# EAGLE design panatap (EAGLE 8.2.2)
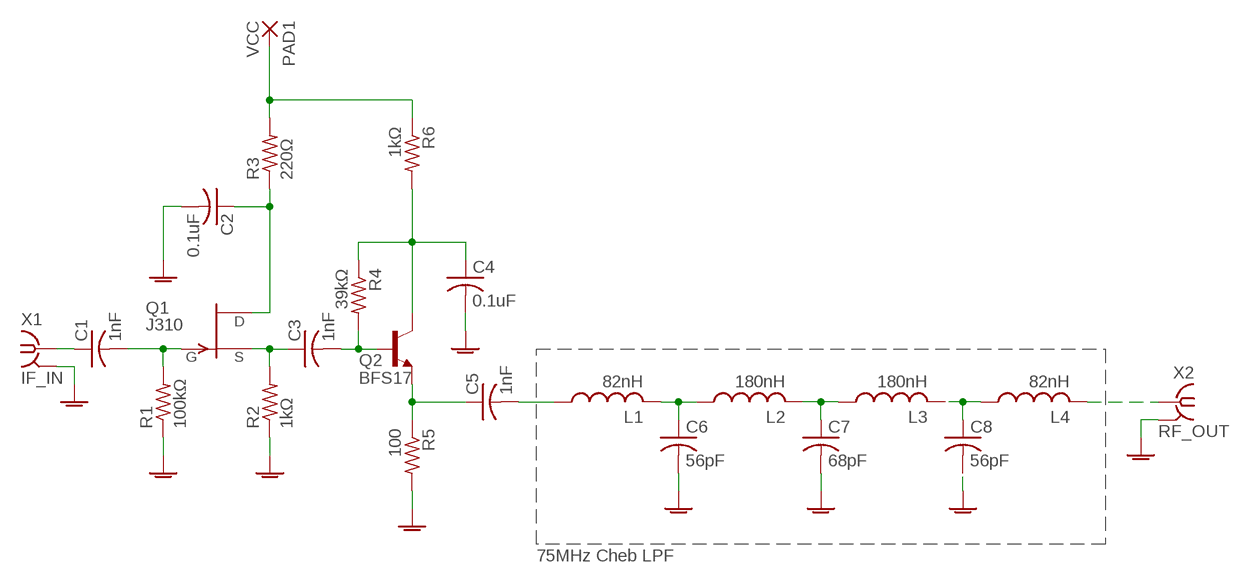
[diagram p0: schematic, sheet 1]

## Parts
C1  1nF  C-USC1206  [C1206]
C2  0.1uF  C-USC1206  [C1206]
C3  1nF  C-USC1206  [C1206]
C4  0.1uF  C-USC1206  [C1206]
C5  1nF  C-USC1206  [C1206]
C6  56pF  C-USC1206  [C1206]
C7  68pF  C-USC1206  [C1206]
C8  56pF  C-USC1206  [C1206]
L1  82nH  L-USL2012C  [L2012C]
L2  180nH  L-USL2012C  [L2012C]
L3  180nH  L-USL2012C  [L2012C]
L4  82nH  L-USL2012C  [L2012C]
PAD1  VCC  WIREPADSMD2,54-5,08  [SMD2,54-5,08]
Q1  J310  SST201  [SOT23]
Q2  BFS17  BC846  [SOT23]
R1  100kΩ  R-US_R1206  [R1206]
R2  1kΩ  R-US_R1206  [R1206]
R3  220Ω  R-US_R1206  [R1206]
R4  39kΩ  R-US_R1206  [R1206]
R5  100  R-US_R1206  [R1206]
R6  1kΩ  R-US_R1206  [R1206]
X1  IF_IN  SMA-142-0701-801/806  [J502-ND-142-0701-801/806]
X2  RF_OUT  SMA-142-0701-801/806  [J502-ND-142-0701-801/806]

## Nets
GNDA: C2.2 C4.2 C6.2 C7.2 C8.2 R1.1 R2.1 R5.2 X1.G@1 X1.G@2 X1.G@3 X1.G@4 X2.G@1 X2.G@2 X2.G@3 X2.G@4
N$1: C5.1 Q2.2(E) R5.1
N$2: C5.2 L1.1
N$3: C6.1 L1.2 L2.1
N$4: C3.2 Q2.1(B) R4.2
N$5: C3.1 Q1.2(S) R2.2
N$6: C1.2 Q1.3(G) R1.2
N$7: C1.1 X1.1
N$8: PAD1.1(P) R3.2 R6.1
N$9: C2.1 Q1.1(D) R3.1
N$10: C4.1 Q2.3(C) R4.1 R6.2
N$11: C7.1 L2.2 L3.1
N$12: L4.2 X2.1
N$13: C8.1 L3.2 L4.1

## Notes on the sheet
- 75MHz Cheb LPF

## Library data of the parts
C1-C8 = resistor:C-US: CAPACITOR, American symbol
L1-L4 = resistor:L-US: INDUCTOR, American symbol
PAD1 = wirepad:WIREPAD: Wire PAD connect wire on PCB
Q1 = transistor-fet:?20*: TEMIC / Siliconix N-Channel JFET Source: JFET-J201_Siliconix_data.pdf
Q2 = transistor:BC846: NPN TRANSISTOR
R1-R6 = resistor:R-US_: RESISTOR, American symbol
X1 X2 = con-coax:SMA-: SMA 50 Ohm End Launch Jack Receptacle - Round Contact Johnson Components Source: www.johnsoncomponents.com .. J502-ND.pdf; MF: JOHNSON COMPONENTS; MPN: 142-0701-801; OC_FARNELL: 1608592; OC_NEWARK: 90F2624

## Board
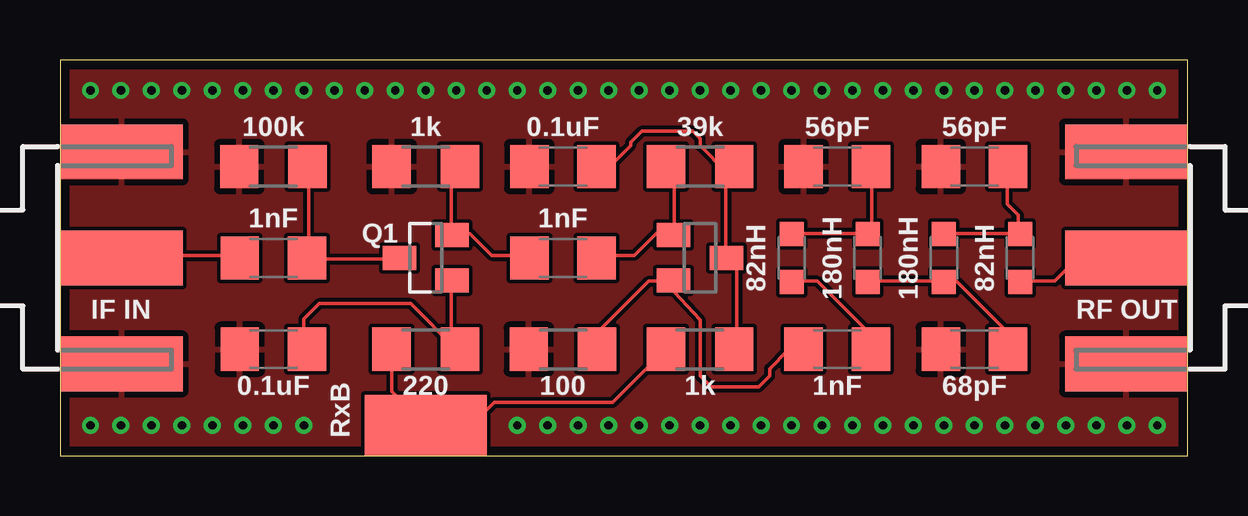
[diagram p1: board, top side]
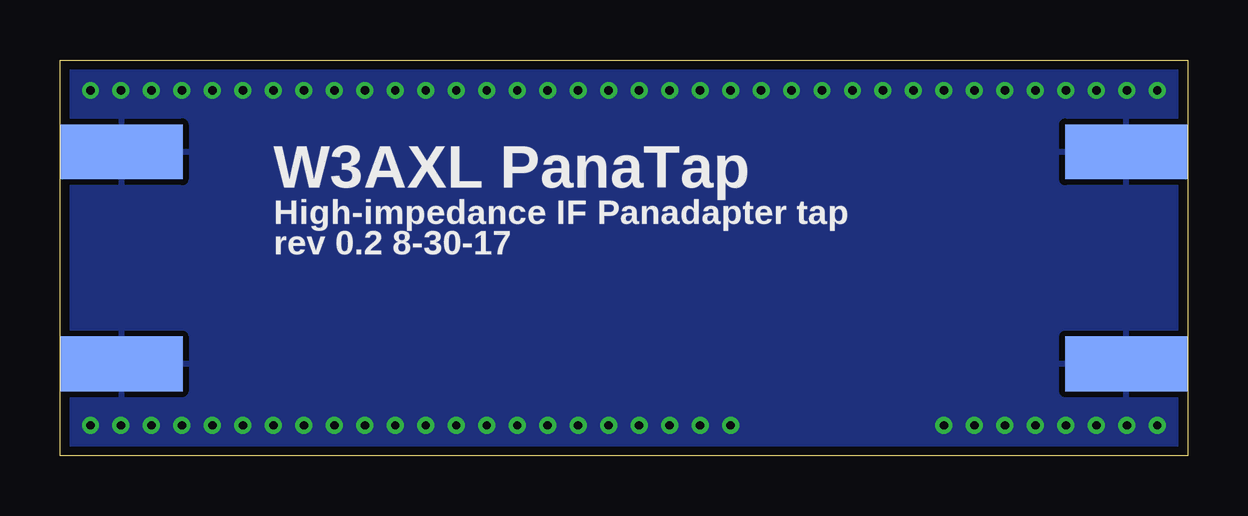
[diagram p2: board, bottom side, seen from below]

Size 46.99 x 16.51 mm. Coordinates in mm from the lower left corner, seen from the top.
Outline: 0,0 46.99,0 46.99,16.51 0,16.51 0,0
Copper layers (1*16): Top 0.0356mm / dielectric 1.5011mm / Bottom 0.0356mm
Design rules "LaenPCBOrder": minimum track width 6mil, minimum drill 13mil, track to track 6mil, track to pad 6mil, pad to pad 6mil, via to via 6mil, smd to smd 6mil, copper to edge 15mil, drill to drill 6mil, minimum pad ring 7mil, minimum via ring 7mil, stop-mask expansion 3mil, vias tented up to drill 0mil, thermal gap 10mil

### Footprints (pad centres in the part's own frame; a part is rotated, then mirrored left to right if it is on the bottom)
C1206 = smd 1.6 x 1.8: 1 -1.4,0; 2 1.4,0
L2012C = smd 1 x 1: 1 -1,0; 2 1,0
SMD2,54-5,08 = smd 2.54 x 5.08: 1 0,0
SOT23 = smd 1 x 1.4: 1 -0.95,-1.1; 2 0.95,-1.1; 3 0,1.1
R1206 = smd 1.6 x 1.803: 1 -1.422,0; 2 1.422,0
J502-ND-142-0701-801/806 = smd 5.08 x 2.286: 1 2.565,0; G@1 2.565,4.42; G@2 2.565,-4.42 | smd 5.08 x 2.286 bottom: G@3 2.565,4.42; G@4 2.565,-4.42

### Placement (x,y rotation side)
C1  8.89,8.25 0 top
C2  8.89,4.45 180 top
C3  20.95,8.25 0 top
C4  20.95,12.07 180 top
C5  32.38,4.45 0 top
C6  32.38,12.07 180 top
C7  38.1,4.45 180 top
C8  38.1,12.07 180 top
L1  30.48,8.25 90 top
L2  33.66,8.25 270 top
L3  36.83,8.25 90 top
L4  40.01,8.25 270 top
PAD1  15.24,1.27 270 top
Q1  15.24,8.25 90 top
Q2  26.67,8.25 270 top
R1  8.89,12.07 0 top
R2  15.24,12.07 0 top
R3  15.24,4.45 180 top
R4  26.67,12.07 180 top
R5  20.95,4.45 180 top
R6  26.67,4.45 0 top
X1  0,8.25 0 top
X2  46.99,8.25 180 top

### Tracks (layer width: path | path; a pad name or v marks a point on that pad's centre or on a via)
GNDA  (via drill 0.35)
  other vias: 1.27,15.24 1.27,1.27 45.72,15.24 2.54,15.24 2.54,1.27 3.81,1.27 5.08,1.27 6.35,1.27 7.62,1.27 8.89,1.27 10.16,1.27 3.81,15.24 5.08,15.24 6.35,15.24 7.62,15.24 8.89,15.24 10.16,15.24 11.43,15.24 12.7,15.24 13.97,15.24 15.24,15.24 16.51,15.24 17.78,15.24 19.05,15.24 20.32,15.24 21.59,15.24 22.86,15.24 24.13,15.24 25.4,15.24 26.67,15.24 27.94,15.24 29.21,15.24 30.48,15.24 31.75,15.24 33.02,15.24 34.29,15.24 35.56,15.24 36.83,15.24 38.1,15.24 39.37,15.24 40.64,15.24 41.91,15.24 43.18,15.24 44.45,15.24 45.72,1.27 44.45,1.27 43.18,1.27 41.91,1.27 40.64,1.27 39.37,1.27 38.1,1.27 36.83,1.27 35.56,1.27 34.29,1.27 33.02,1.27 31.75,1.27 30.48,1.27 29.21,1.27 27.94,1.27 26.67,1.27 25.4,1.27 24.13,1.27 22.86,1.27 21.59,1.27 20.32,1.27 19.05,1.27
  pour Top: 0,16.51 46.99,16.51 46.99,0 0,0
  pour Bottom: 0,16.51 46.99,16.51 46.99,0 0,0
N$1
  Top 0.152: R5.1 22.4,4.55 22.4,5.16 24.54,7.29 25.45,7.29 Q2.2 25.6,7.29 25.6,6.83 26.67,5.66 26.67,3.33 27.13,2.87 29.11,2.87 29.57,3.33 29.57,3.63 30.33,4.39 30.94,4.39 C5.1
N$2
  Top 0.152: L1.1 30.48,7.29 31.55,7.29 33.68,5.16 33.68,4.55 C5.2
N$3
  Top 0.152: L1.2 30.48,9.27 33.53,9.27 L2.1 33.68,9.27 33.83,9.42 33.83,12.01 C6.1
N$4
  Top 0.152: R4.2 25.3,12.01 25.6,11.71 25.6,9.27 Q2.1 25.45,9.27 24.84,9.27 23.93,8.36 22.4,8.36 C3.2
N$5
  Top 0.152: R2.2 16.61,12.01 16.31,11.71 16.31,9.27 Q1.2 16.46,9.27 17.07,9.27 17.98,8.36 19.51,8.36 C3.1
N$6
  Top 0.152: Q1.3 14.02,8.2 10.36,8.2 C1.2 10.36,8.36 10.36,12.01 R1.2
N$7
  Top 0.152: C1.1 7.47,8.36 2.59,8.36 X1.1
N$8
  Top 0.152: R3.2 13.82,2.69 PAD1.1 17.14,1.27 18.1,2.22 23.03,2.22 R6.1
N$9
  Top 0.152: Q1.1 16.31,7.29 16.31,4.85 16.61,4.55 R3.1 16.51,4.45 14.61,6.35 10.79,6.35 10.16,5.71 10.16,4.57 C2.1
N$10
  Top 0.152: 27.89,11.86 28.04,12.01 R4.1 27.89,11.86 | 27.89,11.86 27.74,11.71 27.74,8.36 Q2.3 27.89,8.2 28.19,7.9 28.19,4.55 R6.2 | 27.89,11.86 27.74,11.86 26.67,12.93 26.67,13.23 26.36,13.54 24.23,13.54 23.77,13.08 23.77,12.93 23.01,12.17 22.4,12.17 C4.1
N$11
  Top 0.152: L2.2 33.68,7.29 36.73,7.29 L3.1 36.88,7.29 37.34,7.29 39.47,5.16 39.47,4.55 C7.1
N$12
  Top 0.152: L4.2 40.08,7.29 41.45,7.29 42.37,8.2 44.35,8.2 X2.1
N$13
  Top 0.152: 39.93,9.27 36.88,9.27 L3.2 | 39.93,9.27 39.93,10.03 39.47,10.49 39.47,12.01 C8.1 | 39.93,9.27 L4.1

### Text on the board
tPlace: 100k | 1k | 0.1uF | 39k | 56pF | 56pF | 1nF | 1nF | Q1 | 82nH | 180nH | 180nH | 82nH | IF IN | RF OUT | 0.1uF | 220 | 100 | 1k | 1nF | 68pF | RxB
bPlace: W3AXL PanaTap | High-impedance IF Panadapter tap | rev 0.2 8-30-17